# EAGLE design OpenEVSE_ESP32_v1 (EAGLE 9.5.0)
COMPANY: ADAFRUIT INDUSTRIES; DRAWN: KTOWN; REV: B
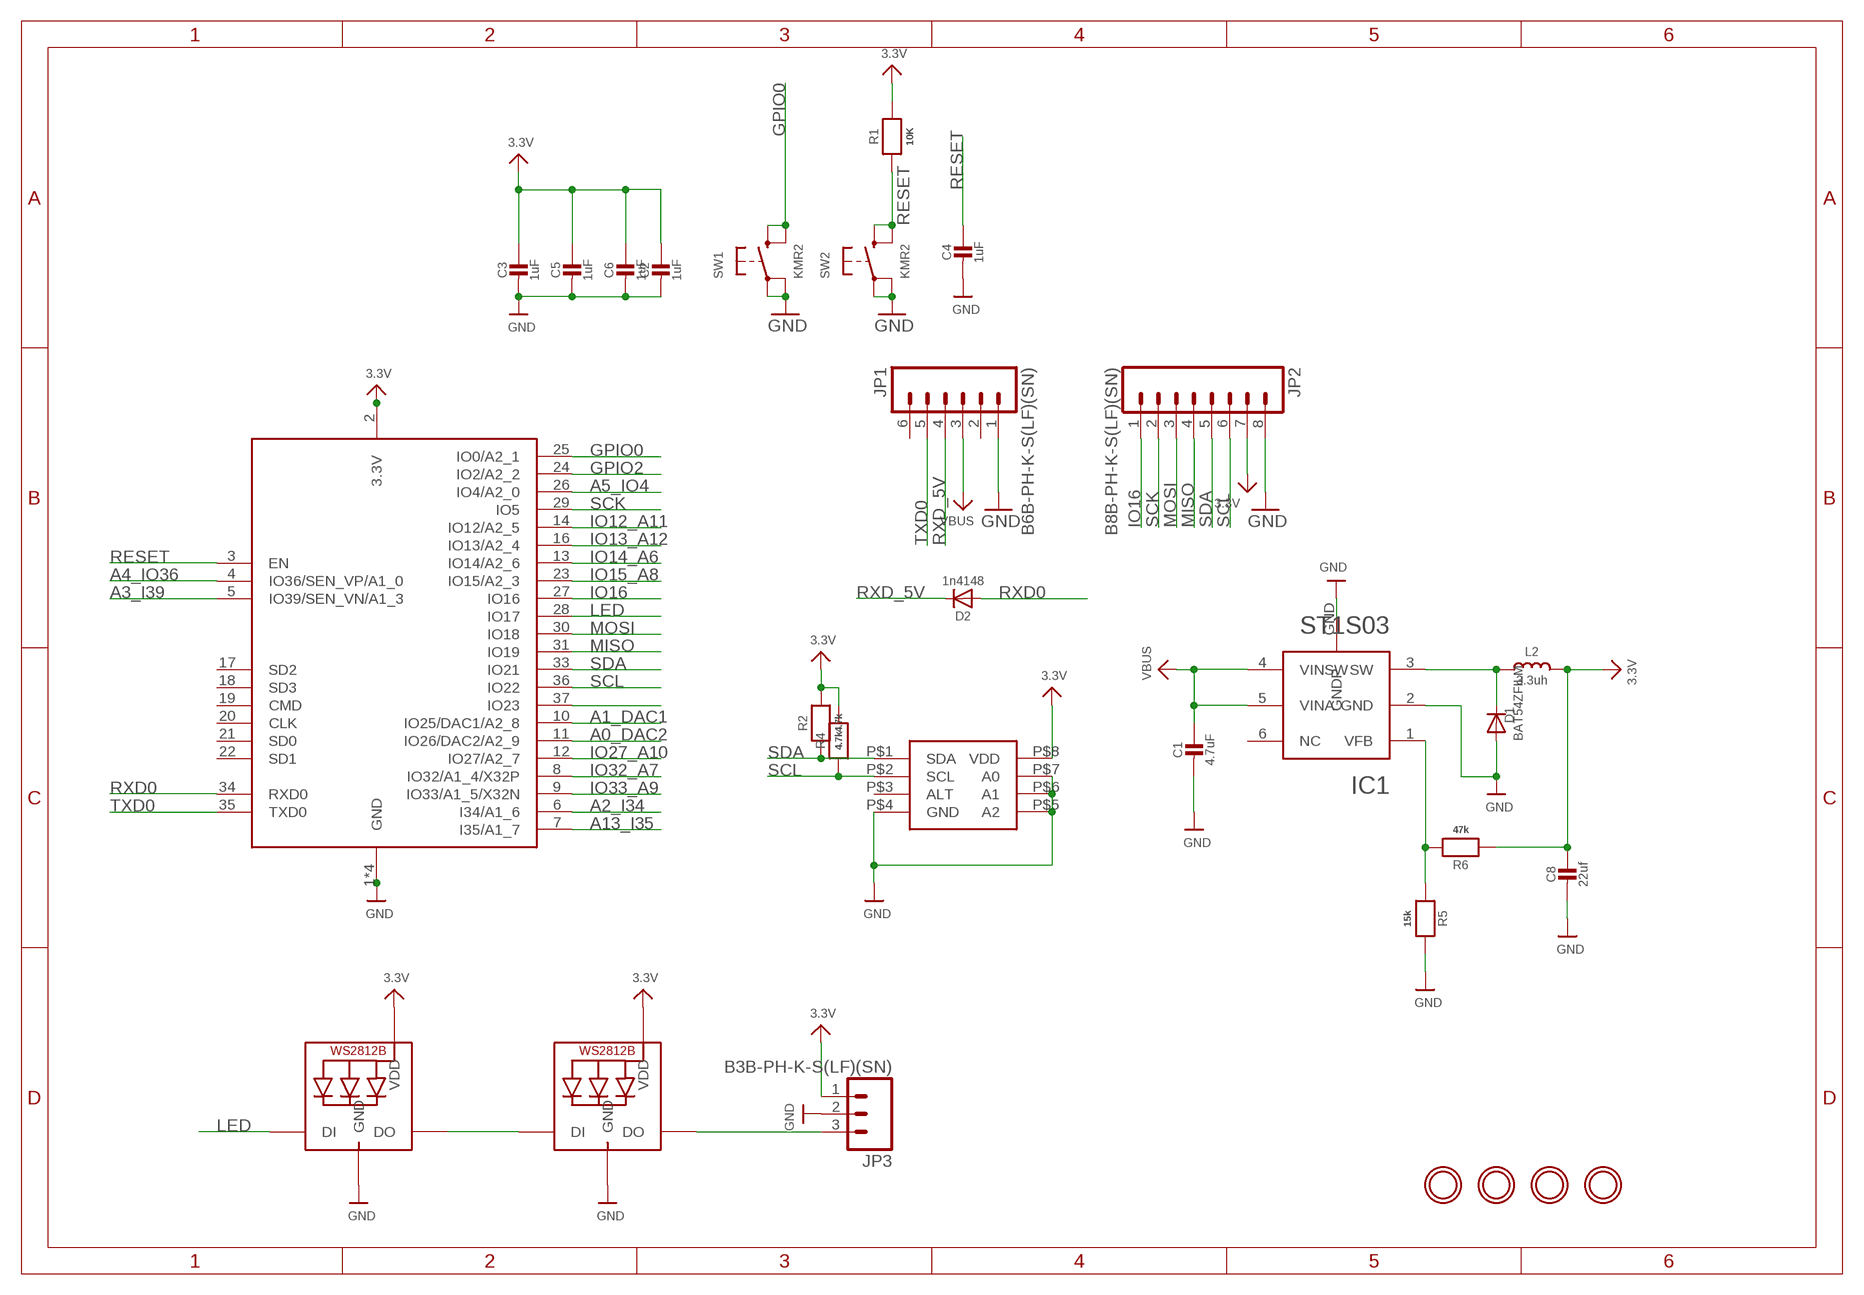
[diagram p0: schematic, sheet 1]

## Parts
C1  4.7uF  CAP_CERAMIC0603_NO  [0603-NO]
C2  1uF  CAP_CERAMIC0603_NO  [0603-NO]
C3  1uF  CAP_CERAMIC0603_NO  [0603-NO]
C4  1uF  CAP_CERAMIC0603_NO  [0603-NO]
C5  1uF  CAP_CERAMIC0603_NO  [0603-NO]
C6  1uF  CAP_CERAMIC0603_NO  [0603-NO]
C8  22uf  CAP_CERAMIC0603_NO  [0603-NO]
D1  BAT54ZFILM  DIODESOD-123  [SOD-123]
D2  1n4148  DIODESOD-323  [SOD-323]
IC1  ST1S03  [DFQN6D]
IC2  MCP9808  [MSOP8]
JP1  B6B-PH-K-S(LF)(SN)  JST6  [JST6]
JP2  B8B-PH-K-S(LF)(SN)  JST8  [JST8]
JP3  B3B-PH-K-S(LF)(SN)  M03JST-PTH-VERT  [JST-3-PTH-VERT]
L2  3.3uh  MICROBUILDER_INDUCTORNR5040  [MICROBUILDER_INDUCTOR_5X5MM_NR5040_NOTHERMALS]
LED1  SK6812MINI  MICROBUILDER_WS2812B3535  [MICROBUILDER_LED3535]
LED2  SK6812MINI  MICROBUILDER_WS2812B3535  [MICROBUILDER_LED3535]
R1  10K  RESISTOR_0603_NOOUT  [0603-NO]
R2  4.7k  RESISTOR_0603_NOOUT  [0603-NO]
R4  4.7k  RESISTOR_0603_NOOUT  [0603-NO]
R5  15k  RESISTOR_0603_NOOUT  [0603-NO]
R6  47k  RESISTOR_0603_NOOUT  [0603-NO]
SW1  KMR2  SWITCH_TACT_SMT4.6X2.8  [BTN_KMR2_4.6X2.8]
SW2  KMR2  SWITCH_TACT_SMT4.6X2.8  [BTN_KMR2_4.6X2.8]
U$8  MOUNTINGHOLE2.5  [MOUNTINGHOLE_2.5_PLATED]
U$17  MOUNTINGHOLE2.5  [MOUNTINGHOLE_2.5_PLATED]
U$25  MOUNTINGHOLE2.5  [MOUNTINGHOLE_2.5_PLATED]
U$27  MOUNTINGHOLE2.5  [MOUNTINGHOLE_2.5_PLATED]
X2  ESP32-WROOM-32  ESP32_WROOM32_SKINNY  [WROOM32_SKINNY]

## Nets
3.3V: C2.1 C3.1 C5.1 C6.1 C8.1 IC2.P$8(VDD) JP2.7 JP3.1 L2.P$2 LED1.2(VDD) LED2.2(VDD) R1.2 R2.2 R4.2 R6.1 X2.2(3.3V)
A0_DAC2: X2.11(IO26/DAC2/A2_9)
A1_DAC1: X2.10(IO25/DAC1/A2_8)
A2_I34: X2.6(I34/A1_6)
A3_I39: X2.5(IO39/SEN_VN/A1_3)
A4_IO36: X2.4(IO36/SEN_VP/A1_0)
A5_IO4: X2.26(IO4/A2_0)
A13_I35: X2.7(I35/A1_7)
GND: C1.2 C2.2 C3.2 C4.2 C5.2 C6.2 C8.2 D1.A IC1.2(GND) IC1.GND(GNDP) IC2.P$4(GND) IC2.P$5(A2) IC2.P$6(A1) IC2.P$7(A0) JP1.1 JP2.8 JP3.2 LED1.4(GND) LED2.4(GND) R5.2 SW1.A'(P1) SW1.A(P) SW2.A'(P1) SW2.A(P) X2.1(GND) X2.15(GND) X2.38(GND) X2.P$1(GND)
GPIO0: SW1.B'(S1) SW1.B(S) X2.25(IO0/A2_1)
GPIO2: X2.24(IO2/A2_2)
IO12_A11: X2.14(IO12/A2_5)
IO13_A12: X2.16(IO13/A2_4)
IO14_A6: X2.13(IO14/A2_6)
IO15_A8: X2.23(IO15/A2_3)
IO16: JP2.1 X2.27(IO16)
IO27_A10: X2.12(IO27/A2_7)
IO32_A7: X2.8(IO32/A1_4/X32P)
IO33_A9: X2.9(IO33/A1_5/X32N)
LED: LED1.1(DI) X2.28(IO17)
MISO: JP2.4 X2.31(IO19)
MOSI: JP2.3 X2.30(IO18)
N$1: JP3.3 LED2.3(DO)
N$2: LED1.3(DO) LED2.1(DI)
N$5: IC1.1(VFB) R5.1 R6.2
N$6: X2.37(IO23)
N$7: D1.C IC1.3(SW) L2.P$1
RESET: C4.1 R1.1 SW2.B'(S1) SW2.B(S) X2.3(EN)
RXD0: D2.A X2.34(RXD0)
RXD_5V: D2.C JP1.4
SCK: JP2.2 X2.29(IO5)
SCL: IC2.P$2(SCL) JP2.6 R4.1 X2.36(IO22)
SDA: IC2.P$1(SDA) JP2.5 R2.1 X2.33(IO21)
TXD0: JP1.5 X2.35(TXD0)
VBUS: C1.1 IC1.4(VINSW) IC1.5(VINA) JP1.3
Unconnected: IC1.6(NC) IC2.P$3(ALT) JP1.2 JP1.6 X2.17(SD2) X2.18(SD3) X2.19(CMD) X2.20(CLK) X2.21(SD0) X2.22(SD1)

## Library data of the parts
C1-C6 C8 = microbuilder:CAP_CERAMIC: Ceramic Capacitors For new designs, use the packages preceded by an '_' character since they are more reliable: The following footprints should be used on most boards: _0402 - Standard footprint for regular board layouts _0603 - Standard footprint for regular board layouts _0805 - Standard footprint for regular board layouts _1206 - Standard footprint for regular board layouts For extremely tight-pitch boards where space is at a premium, the following 'micro-pitch' footprints can be used (smaller pads, no silkscreen outline, etc.): _0402MP - Micro-pitch footprint for very dense/compact boards _0603MP - Micro-pitch footprint for very dense/compact boards _0805MP - Micro-pitch footprint for very dense/compact boards _1206MP - Micro-pitch footprint for very dense/compact boards
D1 = adafruit:DIODE: Diode
D2 = microbuilder:DIODE: Diode
IC1 = OpenEVSE:ST1S03
IC2 = OpenEVSE:MCP9808
JP1 = OpenEVSE:JST6
JP2 = OpenEVSE:JST8
JP3 = SparkFun-Connectors:M03: Header 3 Standard 3-pin 0.1" header. Use with straight break away headers (SKU : PRT-00116), right angle break away headers (PRT-00553), swiss pins (PRT-00743), machine pins (PRT-00117), and female headers (PRT-00115). Molex polarized connector foot print use with SKU : PRT-08232 with associated crimp pins and housings.
L2 = ESP32_v1_SMPS:MICROBUILDER_INDUCTOR: Inductors 0603: 10nH Ceramic Inductor - microwire antenna/RF (Digikey: 712-1434-2-ND) 0805: 560nH Ceramic Inductor - RF (Digikey: 553-1047-1-ND) 270nH Ceramic Inductor - Q = 40@250MHz, +-5%, 1 Ohm DC Resistance (Digikey: 535-10506-2-ND) 1007 (2518 Metric) SMT: 10µH 10% 250mOhm 820mA 1007 Inductor (Digikey: 587-2189-1-ND) 22µH 10% 500mOhm 580mA 1007 Inductor (Digikey: 587-2190-1-ND) 47µH 10% 950mOhm 420mA 1007 Inductor (Digikey: 587-2191-1-ND) 47µH 5% 100mOhm 1A 1008 Inductor (Digikey: 732-1816-1-ND) 5.0x5.0mm (Taiyo Yuden NR5040 Series) 6.8µH 20% 2.3A 64mOhm Inductor (Digikey: 587-2374-2-ND) 5.0x5.0mm (TDK VLC5045 Series) 4.7µH 20% 3.3A 34mOhm Inductor (Digikey: 445-6526-1-ND) 6.8µH 20% 2.7A 46mOhm Inductor (Digikey: 445-6527-1-ND) 6.0x6.0mm (TDK VLC6045 Series) 4.7µH 20% 3.8A 27mOhm Inductor (Digikey: 445-6538-2-ND) 6.8µH 20% 3A 41mOhm Inductor (Digikey: 445-6540-1-ND) 6.2µH 30% 2.2A 45mOhm Inductor (Digikey: SRR5028-6R2YCT-ND) - Not TDK VLC6045 but footprint should match 6.0x6.0mm (TDK SLF6045 Series) 6.8uH 30% 2A 33mOhm Inductor (Digikey: 445-4572-1-ND, Mouser: 810-SLF645T6R8N2R0PF) 6.0x6.0mm (Sumida CDRH5D28 Series) 6.2uH 30% 1.8A 45mOhm Inductor (Digikey: 308-1542-1-ND) Taiyo Yuden NR3015T2R2M - 2.2uH 20% 1.5A (Digikey: 587-1648-2-ND, Mouser: 963-NR3015T2R2M) - Used with TI TPS62172 CoilCraft RFID Transponder Coil - MA5532-AE (For use with AS3935 Lightning Sensor)
LED1 LED2 = Adafruit Circuit Playground Express:MICROBUILDER_WS2812B
R1 R2 R4-R6 = microbuilder:RESISTOR: Resistors For new designs, use the packages preceded by an '_' character since they are more reliable: The following footprints should be used on most boards: _0402 - Standard footprint for regular board layouts _0603 - Standard footprint for regular board layouts _0805 - Standard footprint for regular board layouts _1206 - Standard footprint for regular board layouts For extremely tight-pitch boards where space is at a premium, the following 'micro-pitch' footprints can be used (smaller pads, no silkscreen outline, etc.): _0402MP - Micro-pitch footprint for very dense/compact boards _0603MP - Micro-pitch footprint for very dense/compact boards _0805MP - Micro-pitch footprint for very dense/compact boards _1206MP - Micro-pitch footprint for very dense/compact boards
SW1 SW2 = microbuilder:SWITCH_TACT_SMT: SMT Tact Switches 6x6mm - Digikey: P12940SCT-ND KMR2 (4.6x2.8mm) - Digikey: 401-1426-1-ND EVQ-PQHB55 - Light Touch, 160GF (4.5x4.5mm) - Digikey: P8090SCT-ND KMT0 - KMT021 NGJ LHS (etc.) IP68/Waterproof - Digikey: CKN10289CT-ND
U$8 U$17 U$25 U$27 = microbuilder:MOUNTINGHOLE: Mounting Hole For #2 screws (0.086"/2.18mm width, 0.094"/2.4mm hole) use 2.5mm
X2 = microbuilder:ESP32_WROOM32

## Board
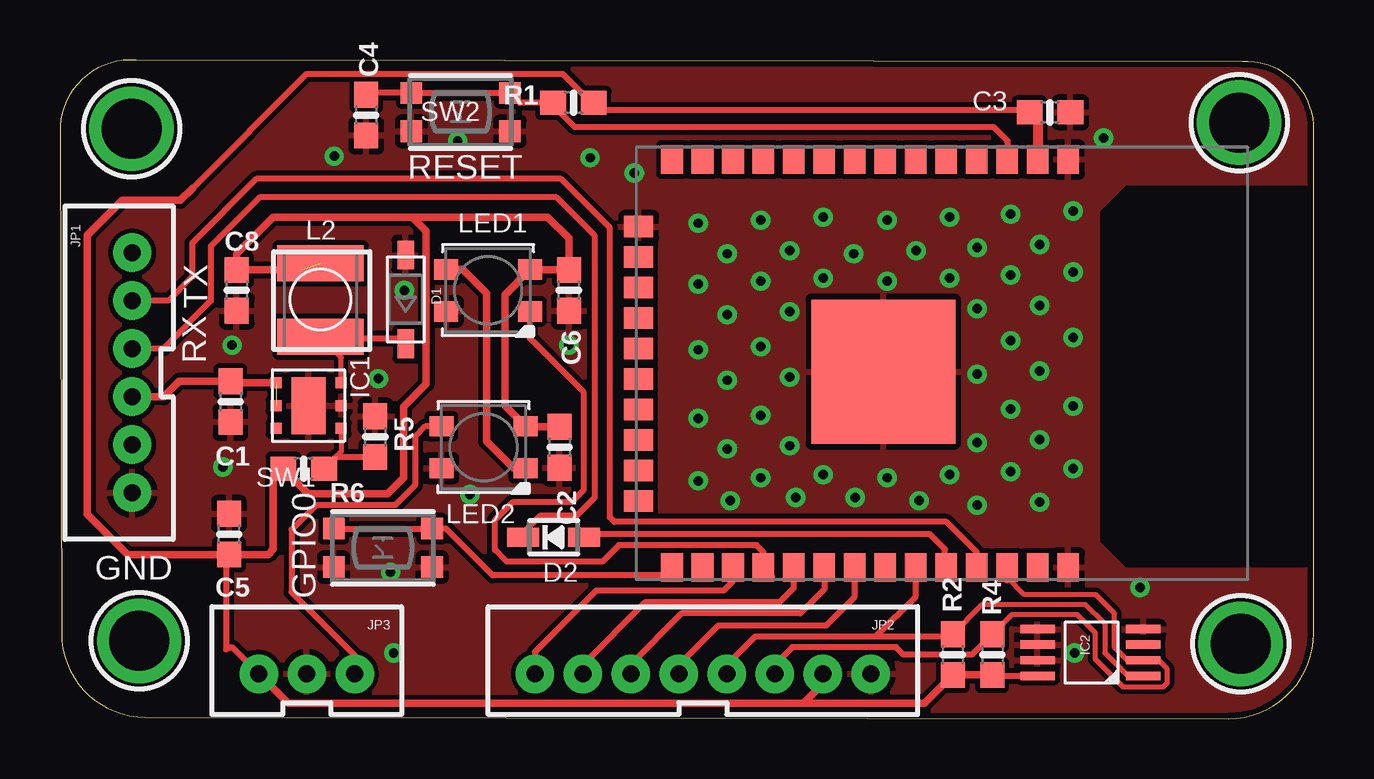
[diagram p1: board, top side]
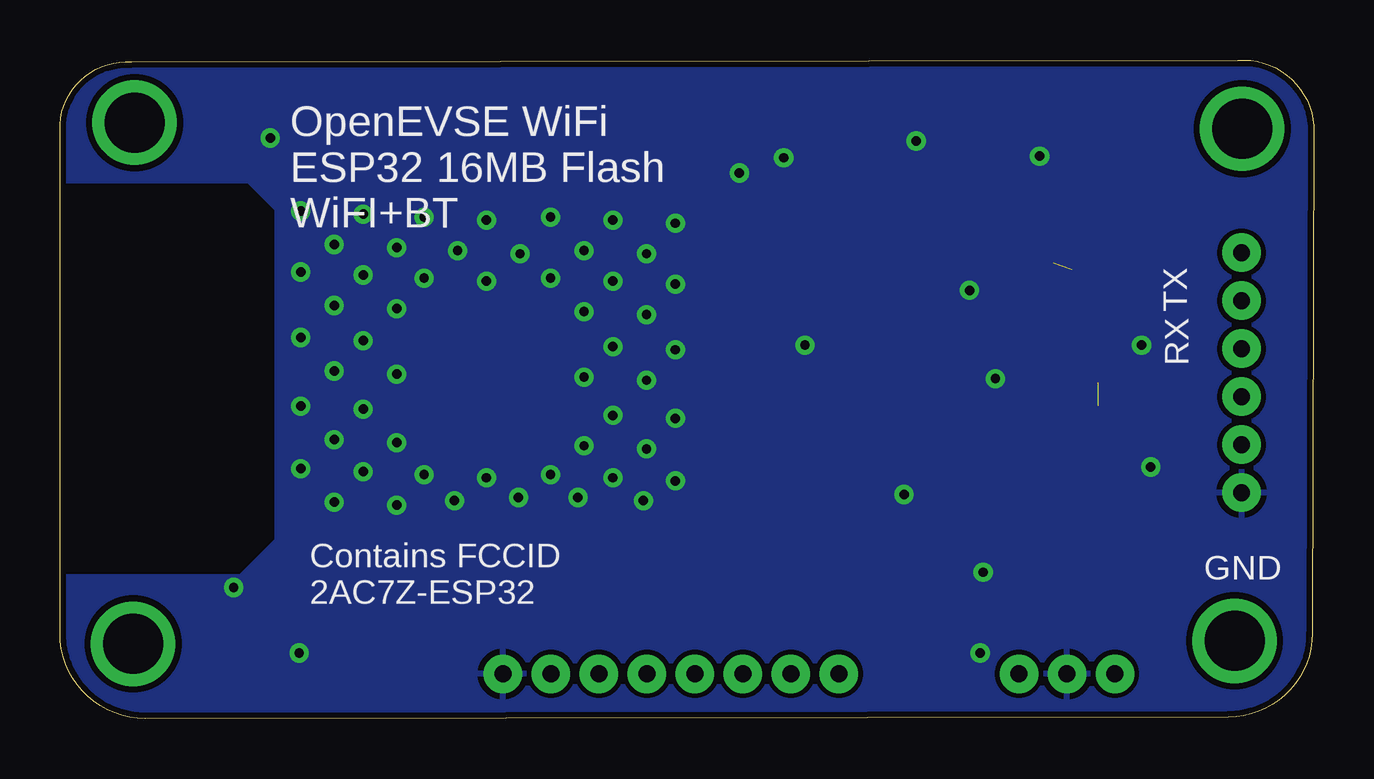
[diagram p2: board, bottom side, seen from below]

Size 52.26 x 27.44 mm. Coordinates in mm from the lower left corner, seen from the top.
Outline: 3.56,0.06 48.7,0 arc90 52.26,3.56 52.26,24.77 arc90 49.28,27.37 3.17,27.43 arc90 0,24.7 0.06,3.56 arc90 3.56,0.06
Copper layers (1*16): Top 0.035mm / dielectric 1.5mm / Bottom 0.035mm
Design rules "adafruit 7-7 *": minimum track width 6mil, minimum drill 15.5mil, track to track 8mil, track to pad 7mil, pad to pad 7mil, via to via 7mil, smd to smd 7mil, copper to edge 10mil, drill to drill 8mil, minimum pad ring 10mil, minimum via ring 8mil, stop-mask expansion 2mil, vias tented up to drill 20mil, thermal gap 10mil

### Footprints (pad centres in the part's own frame; a part is rotated, then mirrored left to right if it is on the bottom)
0603-NO = smd 1.075 x 1: 1 -0.85,0; 2 0.85,0
SOD-123 = smd 1.2 x 0.7: A 1.85,0; C -1.85,0
SOD-323 = smd 1.35 x 0.8: A 1.27,0; C -1.27,0
DFQN6D = smd 0.457 x 0.457: 1 -0.93,-1.31; 2 0.02,-1.31; 3 0.97,-1.31; 4 0.97,1.41; 5 0.02,1.41; 6 -0.93,1.41 | smd 2.362 x 1.397: GND 0.02,0.05
MSOP8 = smd 0.35 x 1.45: P$1 0,0; P$2 0.65,0; P$3 1.3,0; P$4 1.95,0; P$5 1.95,4.4; P$6 1.3,4.4; P$7 0.65,4.4; P$8 0,4.4
JST6 = drill 0.7 pad 1.6: 1 -5,-0.28; 2 -3,-0.28; 3 -1,-0.28; 4 1,-0.28; 5 3,-0.28; 6 5,-0.28
JST8 = drill 0.7 pad 1.6: 1 -7,-0.55; 2 -5,-0.55; 3 -3,-0.55; 4 -1,-0.55; 5 1,-0.55; 6 3,-0.55; 7 5,-0.55; 8 7,-0.55
JST-3-PTH-VERT = drill 0.7 pad 1.6: 1 -2,-0.55; 2 0,-0.55; 3 2,-0.55
MICROBUILDER_INDUCTOR_5X5MM_NR5040_NOTHERMALS = smd 1.5 x 3.6: P$1 -1.55,0; P$2 1.5,0
MICROBUILDER_LED3535 = smd 1 x 0.85: 1 -1.75,0.875; 2 -1.75,-0.875; 3 1.75,-0.875; 4 1.75,0.875
BTN_KMR2_4.6X2.8 = smd 0.9 x 0.9: A 2.05,0.8; A' -2.05,0.8; B 2.05,-0.8; B' -2.05,-0.8
MOUNTINGHOLE_2.5_PLATED = drill 2.5 pad 3.2: P$1 0,0
WROOM32_SKINNY = smd 1.2 x 0.9: 1 -8.5,5; 2 -8.5,3.73; 3 -8.5,2.46; 4 -8.5,1.19; 5 -8.5,-0.08; 6 -8.5,-1.35; 7 -8.5,-2.62; 8 -8.5,-3.89; 9 -8.5,-5.16; 10 -8.5,-6.43; 11 -8.5,-7.7; 12 -8.5,-8.97; 13 -8.5,-10.24; 14 -8.5,-11.51; 25 8.5,-11.51; 26 8.5,-10.24; 27 8.5,-8.97; 28 8.5,-7.7; 29 8.5,-6.43; 30 8.5,-5.16; 31 8.5,-3.89; 32 8.5,-2.62; 33 8.5,-1.35; 34 8.5,-0.08; 35 8.5,1.19; 36 8.5,2.46; 37 8.5,3.73; 38 8.5,5 | smd 0.9 x 1.2: 15 -5.7,-12.9; 16 -4.43,-12.9; 17 -3.16,-12.9; 18 -1.89,-12.9; 19 -0.62,-12.9; 20 0.65,-12.9; 21 1.92,-12.9; 22 3.19,-12.9; 23 4.46,-12.9; 24 5.73,-12.9 | smd 6 x 6: P$1 0.34,-2.7

### Placement (x,y rotation side)
C1  7.11,13.21 270 top
C2  20.83,11.3 270 top
C3  41.26,25.26 0 top
C4  12.76,25.15 270 top
C5  7.05,7.68 90 top
C6  21.21,17.84 270 top
C8  7.37,17.84 270 top
D1  14.41,17.46 90 top
D2  20.57,7.56 0 top
IC1  10.41,13.02 90 top
IC2  45.15,1.78 90 top
JP1  2.73,14.41 90 top
JP2  26.8,2.41 0 top
JP3  10.29,2.41 0 top
L2  10.86,17.46 90 top
LED1  17.84,17.84 180 top
LED2  17.65,11.3 180 top
R1  21.4,25.65 0 top
R2  37.21,2.67 270 top
R4  38.86,2.67 270 top
R5  13.14,11.75 90 top
R6  10.16,10.41 0 top
SW1  13.46,7.11 180 top
SW2  16.7,25.27 180 top
U$8  2.98,24.57 0 top
U$17  49.21,3.11 0 top
U$25  3.3,3.24 0 top
U$27  49.15,24.83 0 top
X2  37.02,14.8 270 top

### Tracks (layer width: path | path; a pad name or v marks a point on that pad's centre or on a via)
3.3V  (1 unrouted)
  Top 0.254: C3.1 40.41,25.32 40.38,25.35 22.47,25.35 22.25,25.57 | 22.25,25.57 20.95,26.86 10.29,26.86 5.52,22.1 | R1.2 22.25,25.57 | R4.2 38.9,1.78 IC2.P$8 | C5.1 6.92,6.71 6.92,2.88 7.18,2.97 JP3.1
  Top 0.305: C8.1 7.37,18.48 | C8.1 10.08,18.69 | 37.15,1.75 R2.2 | R2.2 R4.2 | C8.1 7.37,19.37 8.89,20.89 14.67,20.89 | 14.67,20.89 20.32,20.89 21.21,20 C6.1 19.62,18.69 LED1.2 18.54,17.67 18.54,13.04 LED2.2 19.43,12.15 C2.1 | 5.52,22.1 5.02,21.59 2.6,21.59 1.14,20.13 1.14,8.51 2.82,6.83 C5.1 8.68,6.83 8.89,7.05 8.89,9.99 R6.1 10.35,9.37 13.65,9.37 14.31,10.03 14.31,13 15.26,13.95 15.26,20.3 14.67,20.89 | JP3.1 9.52,0.64 30.99,0.64 | 30.99,0.64 31.8,1.44 JP2.7 | R2.2 36.03,0.64 30.99,0.64
  Top 0.406: C3.1 40.75,24.92 X2.2
GND  (via drill 0.39)
  other vias: 17.08,9.33 42.23,21.15 42.23,18.61 42.23,15.88 42.23,13.02 42.23,10.41 40.83,19.75 40.83,17.21 40.83,14.48 40.83,11.62 40.83,9.02 39.62,21.02 39.62,18.48 39.62,15.75 39.62,12.89 39.62,10.29 38.23,19.62 38.23,17.08 38.23,14.35 38.23,11.49 38.23,8.89 37.08,20.89 37.08,18.35 37.08,10.16 35.69,19.49 26.61,20.64 26.61,18.1 26.61,15.37 26.61,12.51 26.61,9.91 27.81,19.37 27.81,16.83 27.81,14.1 27.81,11.24 27.94,9.08 29.21,20.76 29.21,18.22 29.21,15.49 29.21,12.64 29.21,10.03 30.42,19.49 30.42,16.95 30.42,14.22 30.42,11.37 30.67,9.21 31.81,20.89 31.81,18.35 34.48,20.76 34.48,18.22 33.08,19.37 31.81,10.16 33.15,9.21 34.48,10.03 35.81,9.08 43.5,24.19 45.02,5.46 42.29,2.73 21.21,15.56 11.43,23.43 16.57,24.07 22.1,23.37 23.94,22.73 13.78,6.1 13.91,2.73 7.18,15.56 14.35,17.84 13.27,14.16 6.79,10.48
  pour Top: -5.65,27.94 -5.65,-1.46 53.72,-1.46 53.72,6.16 44.39,6.16 43.24,7.3 43.24,21.21 44.39,22.35 56.13,22.35 56.13,27.94
  pour Bottom: -4.5,-0.8 53.67,-0.8 53.67,3.54 53.59,3.62 53.59,5.91 44.7,5.91 43.18,7.43 43.18,21.22 44.38,22.42 56.76,22.42 61.09,20.78 61.09,28.51 -4.5,28.51
GPIO0
  Top 0.254: SW1.B SW1.B' 16.09,7.91 18.03,5.97 25.51,5.97 X2.25
IO16
  Top 0.254: X2.27 28.05,5.72 27.66,5.33 22.35,5.33 19.8,2.78 JP2.1
LED
  Top 0.203: X2.28 29.7,5.91
  Top 0.254: X2.28 29.32,6.94 29.03,7.23 23.29,7.23 22.61,6.54 18.62,6.54 18.13,7.03 18.13,8.27 18.89,9.03 21.34,9.03 21.82,9.51 21.82,13.61 19.59,15.84 LED1.1
MISO
  Top 0.254: JP2.4 25.8,2.24 27.44,3.89 31.94,3.89 33.13,5.08 X2.31
MOSI
  Top 0.254: X2.30 31.86,5.38 30.86,4.38 25.91,4.38 23.8,2.27 JP2.3
N$1
  Top 0.254: LED2.3 15.23,12.18 14.8,11.75 14.8,9.72 13.97,8.89 10.67,8.89 9.65,7.87 9.65,5.27 12.29,2.64 JP3.3
N$2
  Top 0.305: LED1.3 16.78,18.72 17.78,17.72 17.78,11.56 18.91,10.43 LED2.1
N$5
  Top 0.203: IC1.1 11.72,11.13 R6.2
  Top 0.254: R5.1 11.49,10.9 R6.2 11.41,10.81
N$7
  Top 0.203: IC1.3 11.72,15.05 L2.P$1
  Top 0.254: 10.86,15.85 11.49,15.85 | 11.49,15.85 14.18,15.85 D1.C | 11.41,15.76 11.49,15.85
  Top 0.305: L2.P$1 10.86,15.85
RESET
  Top 0.254: X2.3 39.48,24.05 39.5,24.07 38.93,24.64 21.46,24.64 20.45,25.65 20.16,25.65 | R1.1 20.33,25.63 20.13,25.63 20.16,25.65 | 20.16,25.65 19.17,25.65 SW2.B' SW2.B 12.84,26.07 C4.1 12.89,25.87 12.89,25.66
RXD0
  Top 0.254: X2.34 36.89,6.34 36.89,7.05 36.26,7.68 21.97,7.68 D2.A
RXD_5V
  Top 0.254: D2.C 19.43,7.56 | 19.43,7.56 19.81,7.56 | 19.43,7.56 19.43,7.87 20,8.45 21.53,8.45 22.28,9.19 22.28,20.13 20.69,21.71 8.31,21.71 6.29,19.68 6.29,17.4 4.3,15.41 JP1.4
SCK
  Top 0.254: X2.29 30.58,6.28 30.58,5.44 29.98,4.84 24.38,4.84 21.8,2.25 JP2.2
SCL
  Top 0.203: R4.1 39.69,4.34 42.39,4.34 43.14,3.6 43.14,2.49 44.31,1.32 45.99,1.32 46.15,1.49 46.15,2.07 45.79,2.43 IC2.P$2 | 45.16,2.41 IC2.P$2 | X2.36 39.48,5.89 40.2,5.17 43.17,5.17 43.95,4.38 43.95,2.98 44.5,2.43 IC2.P$2
  Top 0.254: 38.86,3.48 R4.1 38.01,2.67 35.15,2.67 34.84,2.97 30.52,2.97 29.8,2.24 JP2.6 | 39.48,5.76 X2.36
SDA
  Top 0.203: R2.1 38.43,4.74 38.43,4.76 42.75,4.76 43.55,3.96 43.55,2.73 44.5,1.78 IC2.P$1
  Top 0.254: JP2.5 27.8,2.24 28.98,3.43 34.02,3.43 | 34.02,3.43 35.67,5.08 X2.33 | 34.02,3.43 37.12,3.43 R2.1
TXD0
  Top 0.254: X2.35 38.21,6.94 36.96,8.19 23.11,8.19 22.92,8.38 22.92,20.45 20.88,22.49 8.19,22.49 5.51,19.81 5.51,18.4 4.52,17.41 JP1.5
VBUS  (1 unrouted)
  Top 0.305: IC1.4 7.18,13.99 C1.1 4.98,14.06 4.32,13.4 3.03,13.4 JP1.3

### Text on the board
bPlace: OpenEVSE WiFi / ESP32 16MB Flash / WiFI+BT | Contains FCCID / 2AC7Z-ESP32
tNames: RESET | TX | RX | GND | GPIO0
bNames: TX | RX | GND